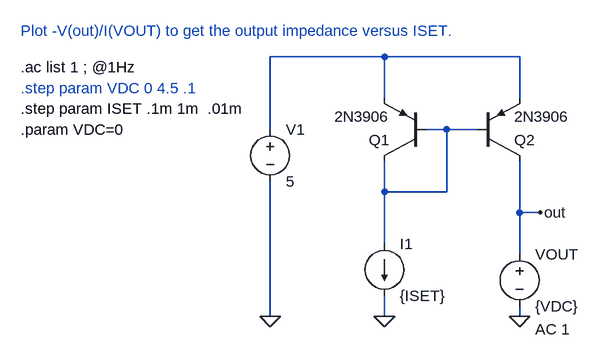
[diagram p0: schematic current_mirror_impedance_ac.asc]
current_mirror_impedance_ac.asc, the LTspice schematic file:
Version 4
SHEET 1 880 680
WIRE 64 64 -112 64
WIRE 272 64 64 64
WIRE 64 128 64 64
WIRE 272 128 272 64
WIRE -112 176 -112 64
WIRE 160 176 128 176
WIRE 208 176 160 176
WIRE 64 272 64 224
WIRE 160 272 160 176
WIRE 160 272 64 272
WIRE 272 304 272 224
WIRE 304 304 272 304
WIRE 64 352 64 272
WIRE 272 368 272 304
WIRE -112 464 -112 256
WIRE 64 464 64 432
WIRE 272 464 272 448
FLAG 64 464 0
FLAG -112 464 0
FLAG 272 464 0
FLAG 304 304 out
SYMBOL pnp 128 224 R180
SYMATTR InstName Q1
SYMATTR Value 2N3906
SYMBOL pnp 208 224 M180
SYMATTR InstName Q2
SYMATTR Value 2N3906
SYMBOL voltage -112 160 R0
SYMATTR InstName V1
SYMATTR Value 5
SYMBOL voltage 272 352 R0
WINDOW 123 24 132 Left 0
WINDOW 39 0 0 Left 0
SYMATTR Value2 AC 1
SYMATTR InstName VOUT
SYMATTR Value {VDC}
SYMBOL current 64 352 R0
SYMATTR InstName I1
SYMATTR Value {ISET}
TEXT -496 80 Left 0 !.ac list 1 ; @1Hz
TEXT -496 112 Left 0 ;.step param VDC 0 4.5 .1
TEXT -496 144 Left 0 !.step param ISET .1m 1m  .01m
TEXT -496 176 Left 0 !.param VDC=0
TEXT -496 24 Left 0 ;Plot -V(out)/I(VOUT) to get the output impedance versus ISET.

The netlist it stands for:
* current_mirror_impedance_ac.asc
Q1 N002 N002 N001 0 2N3906
Q2 out N002 N001 0 2N3906
V1 N001 0 5
VOUT out 0 {VDC} AC 1
I1 N002 0 {ISET}
.model NPN NPN
.model PNP PNP
.lib standard.bjt
.ac list 1 ; @1Hz
* .step param VDC 0 4.5 .1
.step param ISET .1m 1m  .01m
.param VDC=0
* Plot -V(out)/I(VOUT) to get the output impedance versus ISET.
.backanno
.end